# Altium schematic sheet Nucleo.SchDoc
size A
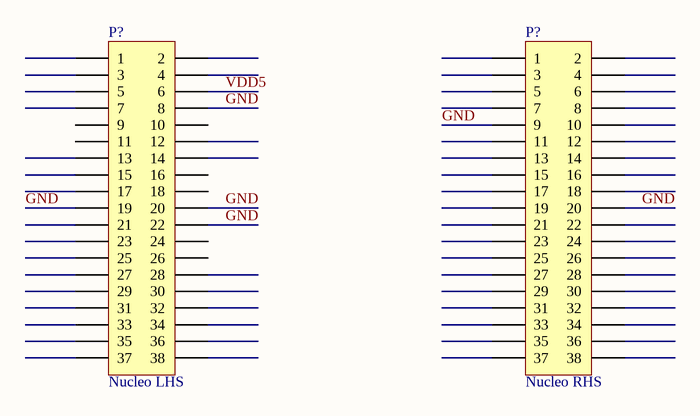
[diagram p0: Nucleo.SchDoc]

## Parts
(Parts that share a designator on the sheet are numbered #1, #2 ... from top to bottom, then left to right.)
P?#1  Nucleo LHS  [HDR2X19]
P?#2  Nucleo RHS  [HDR2X19]

## Nets
GND: P?#1.8 P?#1.19 P?#1.20 P?#1.22 P?#2.9 P?#2.20
VDD5: P?#1.6

Not connected (* = marked no-connect by the designer): P?#1 1 2 3 4 5 7 9 10 11 12 13 14 15 16 17 18 21 23 24 25 26 27 28 29 30 31 32 33 34 35 36 37 38; P?#2 1 2 3 4 5 6 7 8 10 11 12 13 14 15 16 17 18 19 21 22 23 24 25 26 27 28 29 30 31 32 33 34 35 36 37 38

## Library data of the parts
P?#1 P?#2 = Header 19X2: Header, 19-Pin, Dual row; LatestRevisionDate: 17-Jul-2002; LatestRevisionNote: Re-released for DXP Platform.; Publisher: Altium Limited